# EAGLE design PowerSup24V18-20A (EAGLE 8.3.2)

## Sheet 1 of 3: Main Power High Side
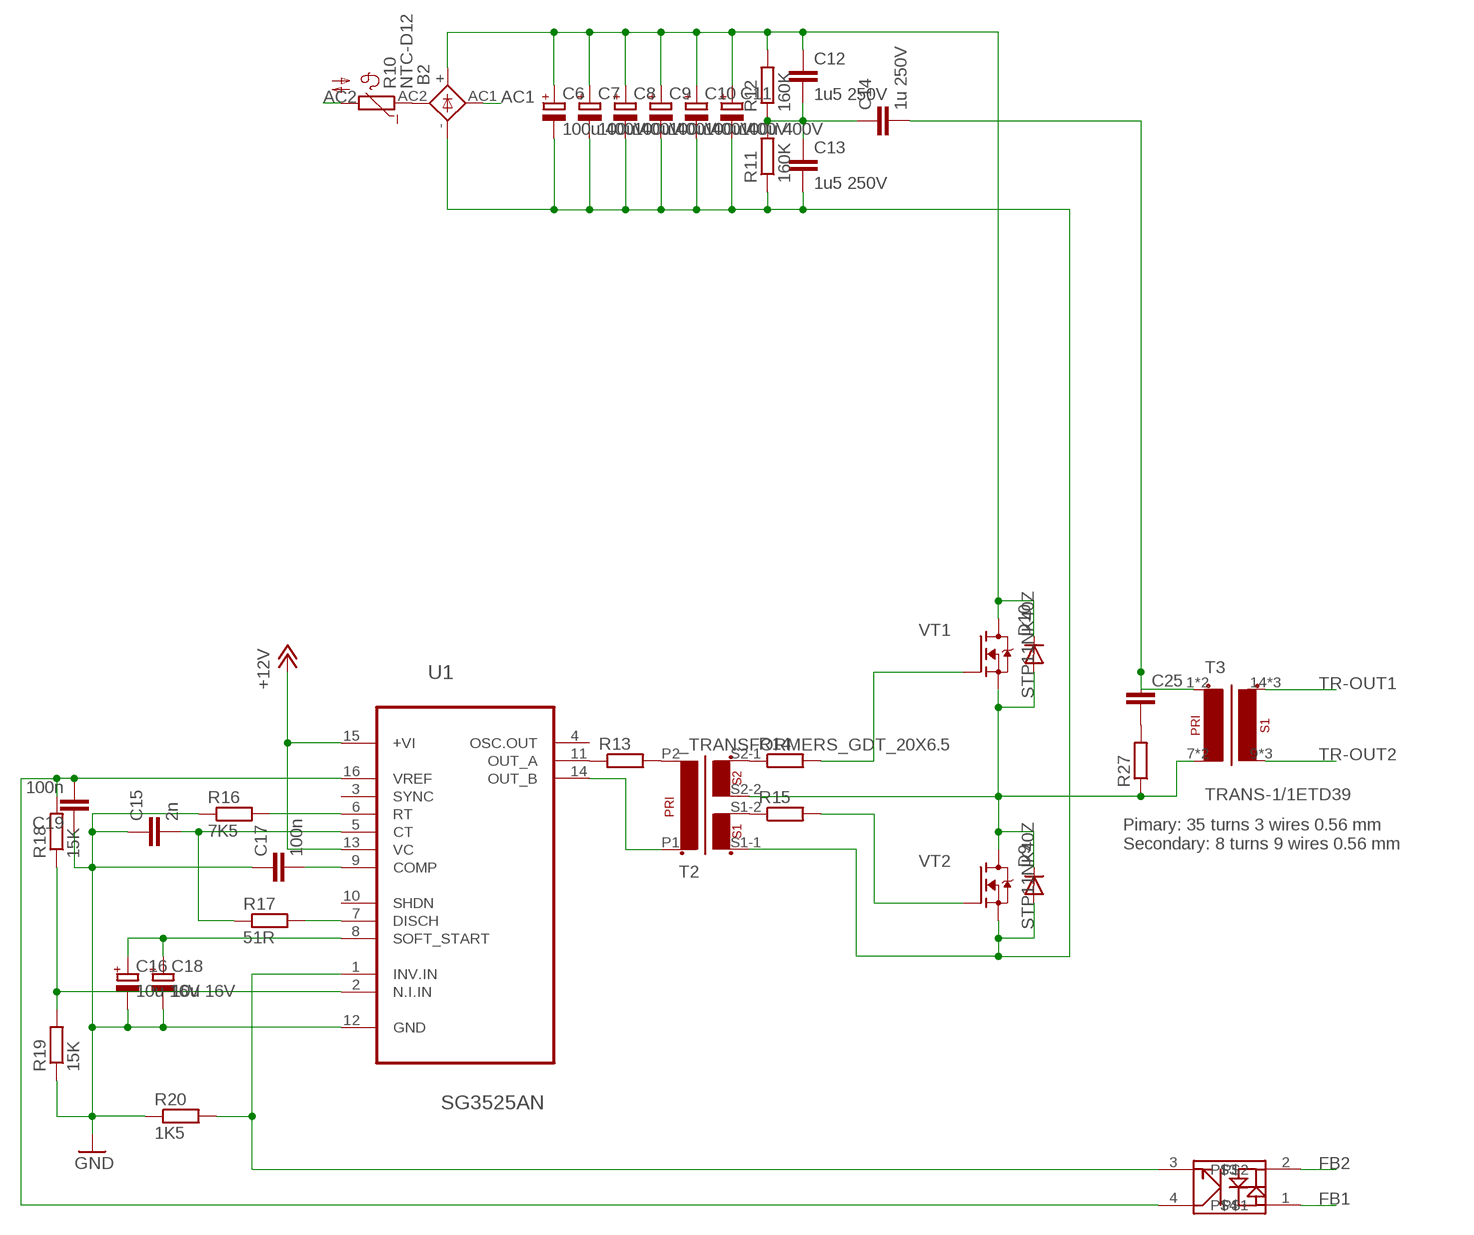
[diagram p0: schematic, sheet 1]

### Parts
B2  RECTIFIERKBL  [KBL]
C6  100u 400V  CPOL-EUE7.5-18  [E7,5-18]
C7  100u 400V  CPOL-EUE7.5-18  [E7,5-18]
C8  100u 400V  CPOL-EUE7.5-18  [E7,5-18]
C9  100u 400V  CPOL-EUE7.5-18  [E7,5-18]
C10  100u 400V  CPOL-EUE7.5-18  [E7,5-18]
C11  100u 400V  CPOL-EUE7.5-18  [E7,5-18]
C12  1u5 250V  C-EU225-074X268  [C225-074X268]
C13  1u5 250V  C-EU225-074X268  [C225-074X268]
C14  1u 250V  C-EU225-074X268  [C225-074X268]
C15  2n  CAP_0805  [C0805]
C16  10u 16V  CAP-POL_3528  [CT3528]
C17  100n  CAP_0805  [C0805]
C18  10u 16V  CAP-POL_3528  [CT3528]
C19  100n  CAP_0805  [C0805]
C25  CAP_C50-024X044  [C050-024X044]
D9  DIODE_ES1J  [DO214AC]
D10  DIODE_ES1J  [DO214AC]
R10  NTC-D12  [NTC-D12]
R11  160K  R_MF-0125  [MF-0125]
R12  160K  R_MF-0125  [MF-0125]
R13  R_1206  [R1206]
R14  R_1206  [R1206]
R15  R_1206  [R1206]
R16  7K5  R_0805  [R0805]
R17  51R  R_0805  [R0805]
R18  15K  R_0805  [R0805]
R19  15K  R_0805  [R0805]
R20  1K5  R_0805  [R0805]
R27  R_MF-2  [MF-2]
T2  _TRANSFORMERS_GDT_20X6.5  [_TRANSFORMERS_GDT_20X6.5]
T3  TRANS-1/1ETD39  [ETD39]
U1  SG3525AN  [DIP254P762X510-16]
U$1  OPTO-EL3H4(TA)-VG  [SSOP4]
VT1  STP11NK40Z  FET-NTO-220  [TO-220V]
VT2  STP11NK40Z  FET-NTO-220  [TO-220V]

### Nets
+12V: U1.13(VC) U1.15(+VI) ; also sheet 3
AC1: B2.AC1(AC2) ; also sheet 3
AC2: R10.2 ; also sheet 3
FB1: U$1.1 ; also sheet 2
FB2: U$1.2 ; also sheet 2
GND: C15.1 C16.- C17.1 C18.- C19.1 R16.1 R19.1 R20.1 U1.12(GND) ; also sheet 3
N$1: B2.AC2(AC1) R10.1
N$12: C12.2 C13.1 C14.1 R11.2 R12.1
N$13: B2.+ C6.+ C7.+ C8.+ C9.+ C10.+ C11.+ C12.1 D10.C R12.2 VT1.2(D)
N$19: B2.- C6.- C7.- C8.- C9.- C10.- C11.- C13.2 D9.A R11.1 T2.S1-1 VT2.3(S)
N$20: R13.1 U1.11(OUT_A)
N$21: T2.P1(P1-1) U1.14(OUT_B)
N$22: R13.2 T2.P2(P1-2)
N$23: R14.1 T2.S2-1
N$24: R15.1 T2.S1-2
N$25: R14.2 VT1.1(G)
N$26: R15.2 VT2.1(G)
N$27: D9.C D10.A R27.1 T2.S2-2 T3.7(P1-2) T3.8(P1-2) VT1.3(S) VT2.2(D)
N$28: C14.2 C25.1 T3.1(P1-1) T3.2(P1-1)
N$29: R16.2 U1.6(RT)
N$30: C15.2 R17.1 U1.5(CT)
N$31: C19.2 R18.2 U1.16(VREF) U$1.4
N$32: R17.2 U1.7(DISCH)
N$33: C16.+ C18.+ U1.8(SOFT_START)
N$34: R18.1 R19.2 U1.2(N.I.IN)
N$35: C17.2 U1.9(COMP)
N$36: R20.2 U1.1(INV.IN) U$1.3
N$44: C25.2 R27.2
TR-OUT1: T3.9(S1-2) T3.10(S1-2) T3.11(S1-2) ; also sheet 2
TR-OUT2: T3.14(S1-1) T3.15(S1-1) T3.16(S1-1) ; also sheet 2
Unconnected: U1.3(SYNC) U1.4(OSC.OUT) U1.10(SHDN)

### Notes on the sheet
- Pimary: 35 turns 3 wires 0.56 mm
  Secondary: 8 turns 9 wires 0.56 mm

## Sheet 2 of 3
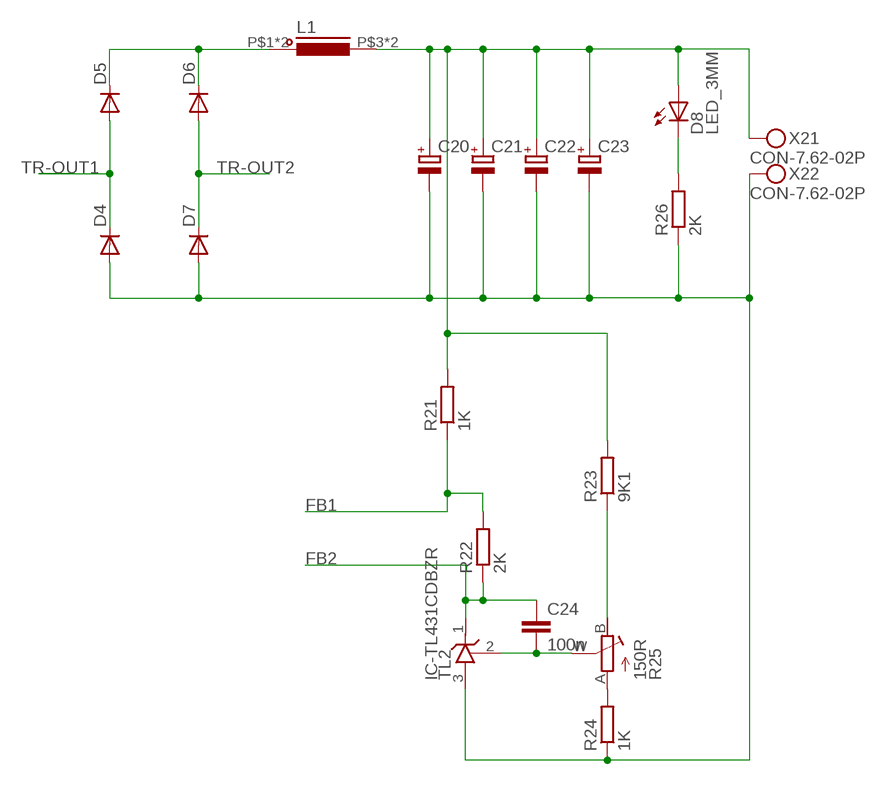
[diagram p1: schematic, sheet 2]

### Parts
C20  CPOL-EUE5-13  [E5-13]
C21  CPOL-EUE5-13  [E5-13]
C22  CPOL-EUE5-13  [E5-13]
C23  CPOL-EUE5-13  [E5-13]
C24  100n  CAP_0805  [C0805]
D4  DIODE_TO-220-2  [TO220ACS]
D5  DIODE_TO-220-2  [TO220ACS]
D6  DIODE_TO-220-2  [TO220ACS]
D7  DIODE_TO-220-2  [TO220ACS]
D8  LED_3MM  [LED3MM]
L1  INDUCTORD26.7  [D26.9/14.7/11.2]
R21  1K  R_0805  [R0805]
R22  2K  R_0805  [R0805]
R23  9K1  R_0805  [R0805]
R24  1K  R_0805  [R0805]
R25  150R  R_POTTURN-X  [RJ9W]
R26  2K  R_0805  [R0805]
TL2  IC-TL431CDBZR  [SOT23]
X2  CON-7.62-02P  [KF25C-7.62-02P-13]

### Nets
FB1: R21.1 R22.2 ; also sheet 1
FB2: C24.1 R22.1 TL2.1(C) ; also sheet 1
N$37: D5.C D6.C L1.P$1 L1.P$2
N$38: C20.- C21.- C22.- C23.- D4.A D7.A R24.1 R26.1 TL2.3(A) X2.P$2
N$39: C20.+ C21.+ C22.+ C23.+ D8.A L1.P$3 L1.P$4 R21.2 R23.2 X2.P$1
N$40: R24.2 R25.A
N$41: R23.1 R25.B(E)
N$42: C24.2 R25.W(S) TL2.2(R)
N$43: D8.K(C) R26.2
TR-OUT1: D4.C D5.A ; also sheet 1
TR-OUT2: D6.A D7.C ; also sheet 1

## Sheet 3 of 3: Standby power +12V
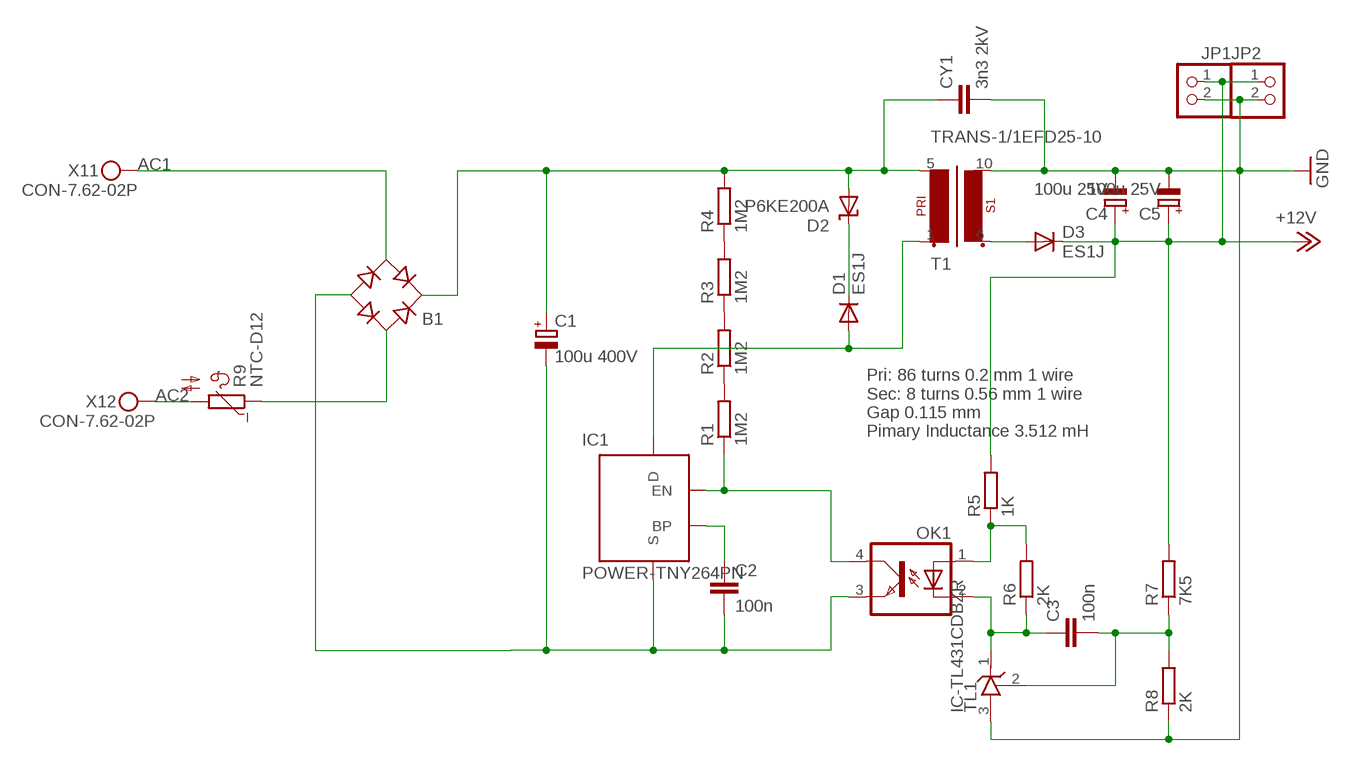
[diagram p2: schematic, sheet 3]

### Parts
B1  RB1A  [RB1A]
C1  100u 400V  CPOL-EUE7.5-18  [E7,5-18]
C2  100n  CAP_0805  [C0805]
C3  100n  CAP_0805  [C0805]
C4  100u 25V  CAP-POL_E2.5-7  [E2,5-7]
C5  100u 25V  CAP-POL_E2.5-7  [E2,5-7]
CY1  3n3 2kV  CYYC7B5  [YC7B5]
D1  ES1J  DIODE_ES1J  [DO214AC]
D2  P6KE200A  SUPRESSORDO-204AC  [DO15-12]
D3  ES1J  DIODE_ES1J  [DO214AC]
IC1  POWER-TNY264PN  [DIP-8B]
JP1  PINHD-1X2  [1X02]
JP2  PINHD-1X2  [1X02]
OK1  OPTOTRANSPC817  [DIL04]
R1  1M2  R_0805  [R0805]
R2  1M2  R_0805  [R0805]
R3  1M2  R_0805  [R0805]
R4  1M2  R_0805  [R0805]
R5  1K  R_0805  [R0805]
R6  2K  R_0805  [R0805]
R7  7K5  R_0805  [R0805]
R8  2K  R_0805  [R0805]
R9  NTC-D12  [NTC-D12]
T1  TRANS-1/1EFD25-10  [EFD25_10PIN]
TL1  IC-TL431CDBZR  [SOT23]
X1  CON-7.62-02P  [KF25C-7.62-02P-13]

### Nets
+12V: C4.+ C5.+ D3.C JP1.1 JP2.1 R5.2 R7.2 ; also sheet 1
AC1: B1.AC2 X1.P$1 ; also sheet 1
AC2: R9.2 X1.P$2 ; also sheet 1
GND: C4.- C5.- CY1.2 JP1.2 JP2.2 R8.1 T1.10(S1-2) TL1.3(A) ; also sheet 1
N$2: B1.AC1 R9.1
N$3: B1.+ C1.+ CY1.1 D2.A R4.2 T1.5(P1-2)
N$4: B1.- C1.- C2.2 IC1.2(S) IC1.3(S) IC1.7(S) IC1.8(S) OK1.3(EMIT)
N$5: R1.2 R2.1
N$6: R2.2 R3.1
N$7: R3.2 R4.1
N$8: IC1.4(EN) OK1.4(COL) R1.1
N$9: D1.A IC1.5(D) T1.1(P1-1)
N$10: D1.C D2.C
N$11: C2.1 IC1.1(BP)
N$14: C3.1 OK1.2(C) R6.1 TL1.1(C)
N$15: OK1.1(A) R5.1 R6.2
N$16: C3.2 R7.1 R8.2 TL1.2(R)
N$18: D3.A T1.6(S1-1)

### Notes on the sheet
- Pri: 86 turns 0.2 mm 1 wire
  Sec: 8 turns 0.56 mm 1 wire
  Gap 0.115 mm
  Pimary Inductance 3.512 mH

## Library data of the parts
B1 = rectifier:RB1A: RECTIFIER 1 A
B2 = Namenlos:RECTIFIER: DIOTEC RECTIFIER
C1 C6-C11 C20-C23 = rcl:CPOL-EU: POLARIZED CAPACITOR, European symbol
C2 C3 C15 C17 C19 C24 C25 = Namenlos:CAP_
C4 C5 C16 C18 = Namenlos:CAP-POL_
C12-C14 = rcl:C-EU: CAPACITOR, European symbol
CY1 = rcl:CY: Y CAPACITOR for power line
D1 D3-D7 D9 D10 = Namenlos:DIODE_
D2 = Namenlos:SUPRESSOR
D8 = Namenlos:LED_
IC1 = Namenlos:POWER-TNY264PN
JP1 JP2 = pinhead:PINHD-1X2: PIN HEADER
L1 = Namenlos:INDUCTOR
OK1 = Namenlos:OPTOTRANS: SHARP OPTO COUPLER; MPN: PC817X4J000F; OC_FARNELL: 9707727; OC_NEWARK: 97K7059
R1-R8 R11-R24 R26 R27 = Namenlos:R_
R9 R10 = Namenlos:NTC-D12
R25 = Namenlos:R_POT
T1 T3 = Namenlos:TRANS-1/1
T2 = Namenlos:_TRANSFORMERS_GDT_20X6.5
TL1 TL2 = Namenlos:IC-TL431
U1 = Namenlos:SG3525AN: REGULATING PULSE WIDTH MODULATORS; MPN: SG3525AN; OC_FARNELL: 1564368; OC_NEWARK: 89K1506; PACKAGE: PDIP-16; SUPPLIER: STMICROELECTRONICS
U$1 = Namenlos:OPTO-EL3H4(TA)-VG
VT1 VT2 = Namenlos:FET-N
X1 X2 = Namenlos:CON-7.62-02P

## Board
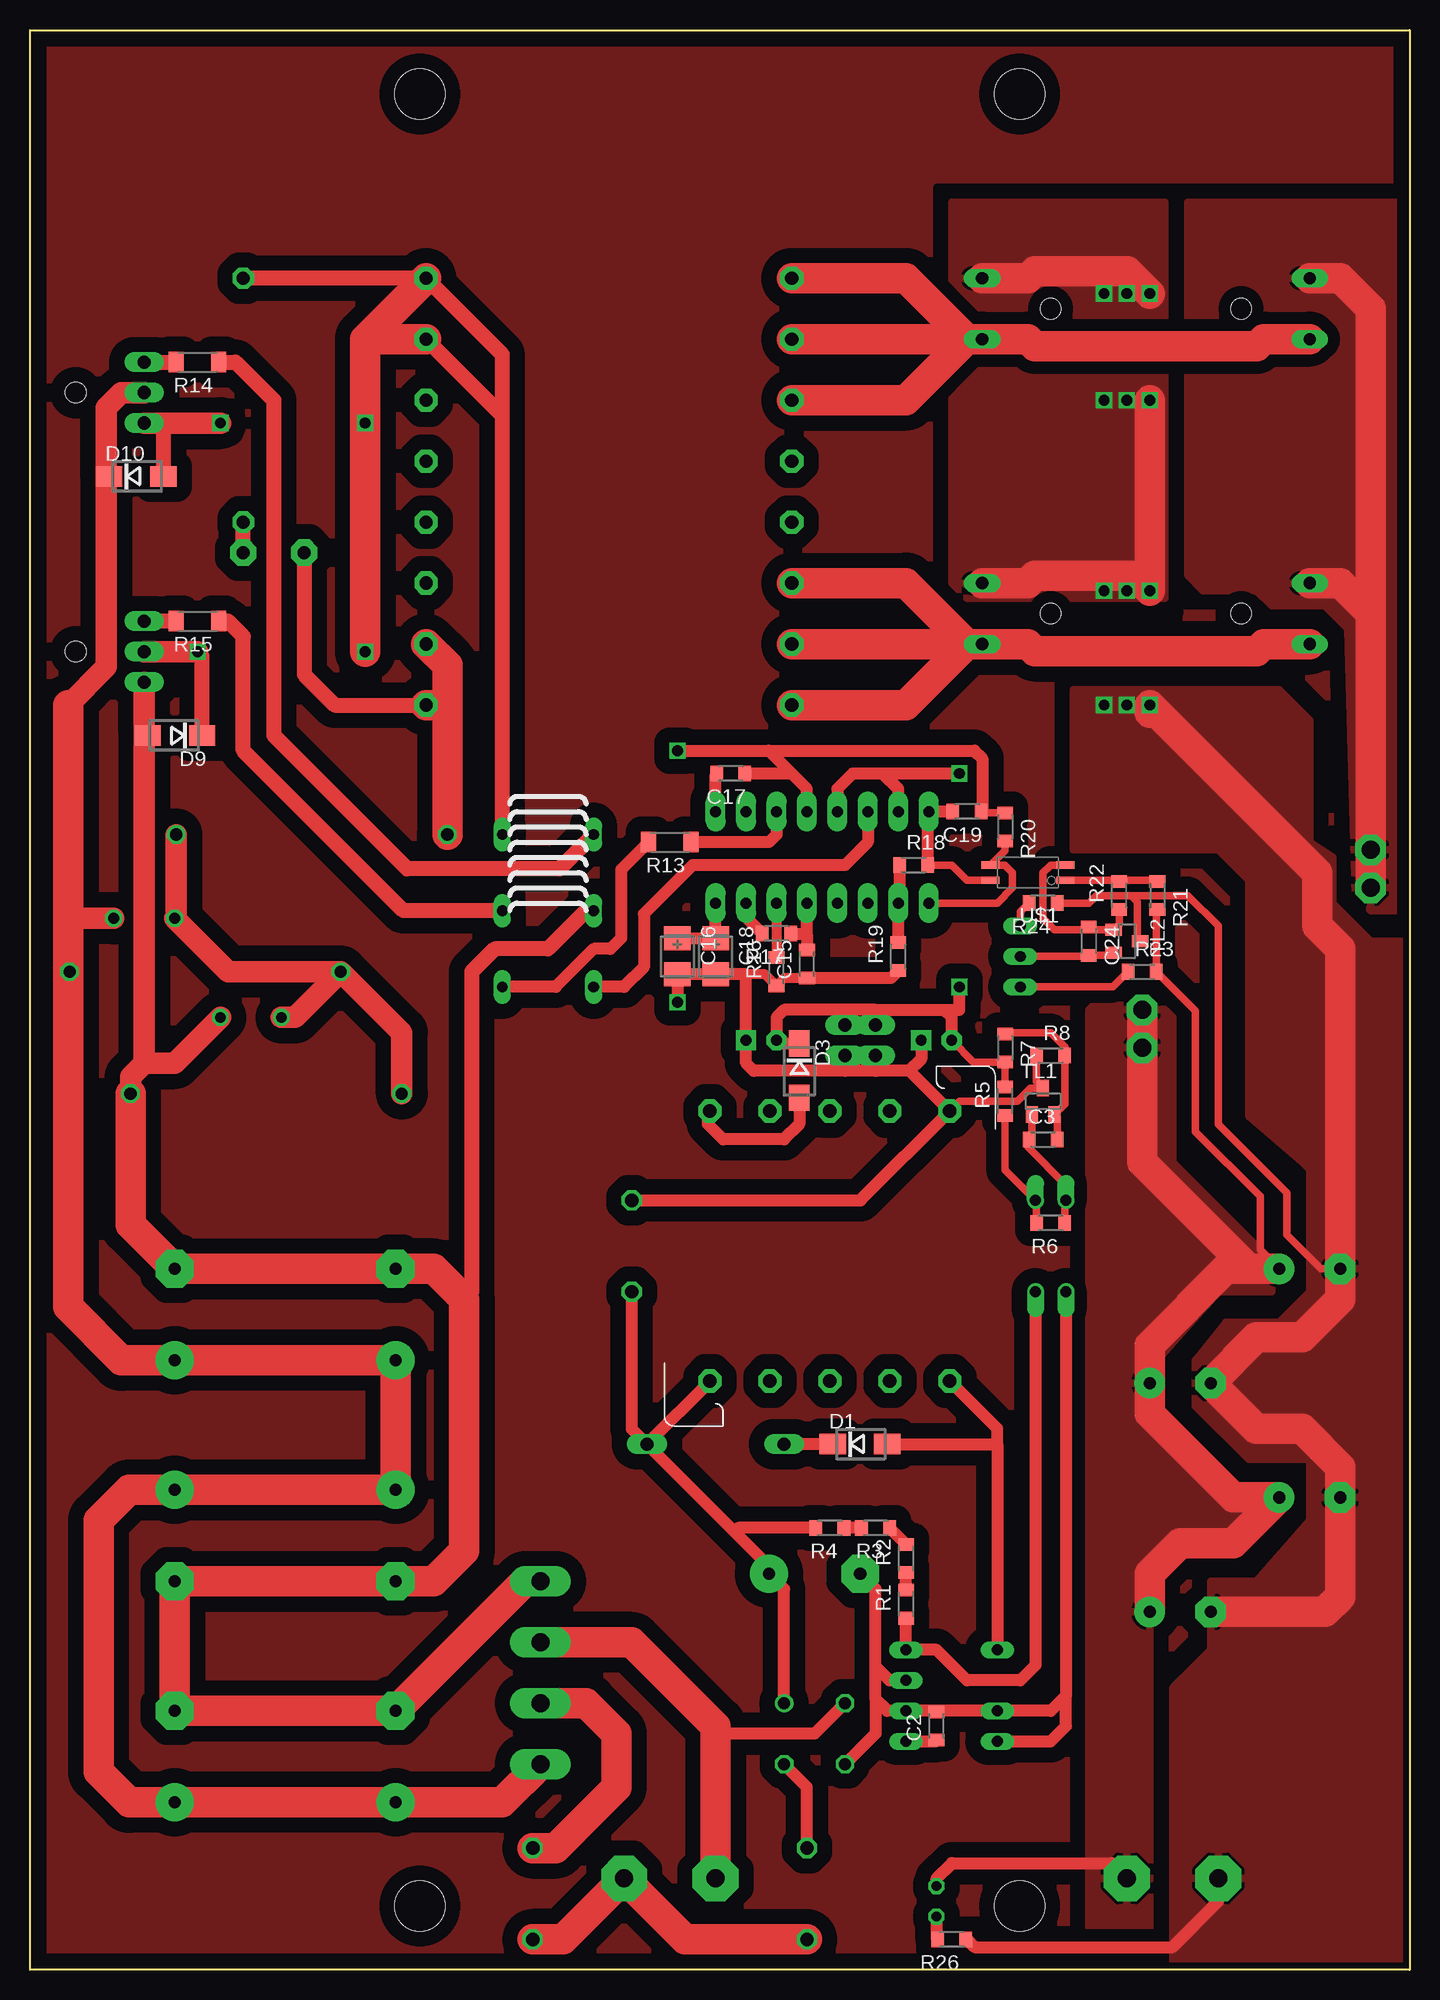
[diagram p3: board, top side]
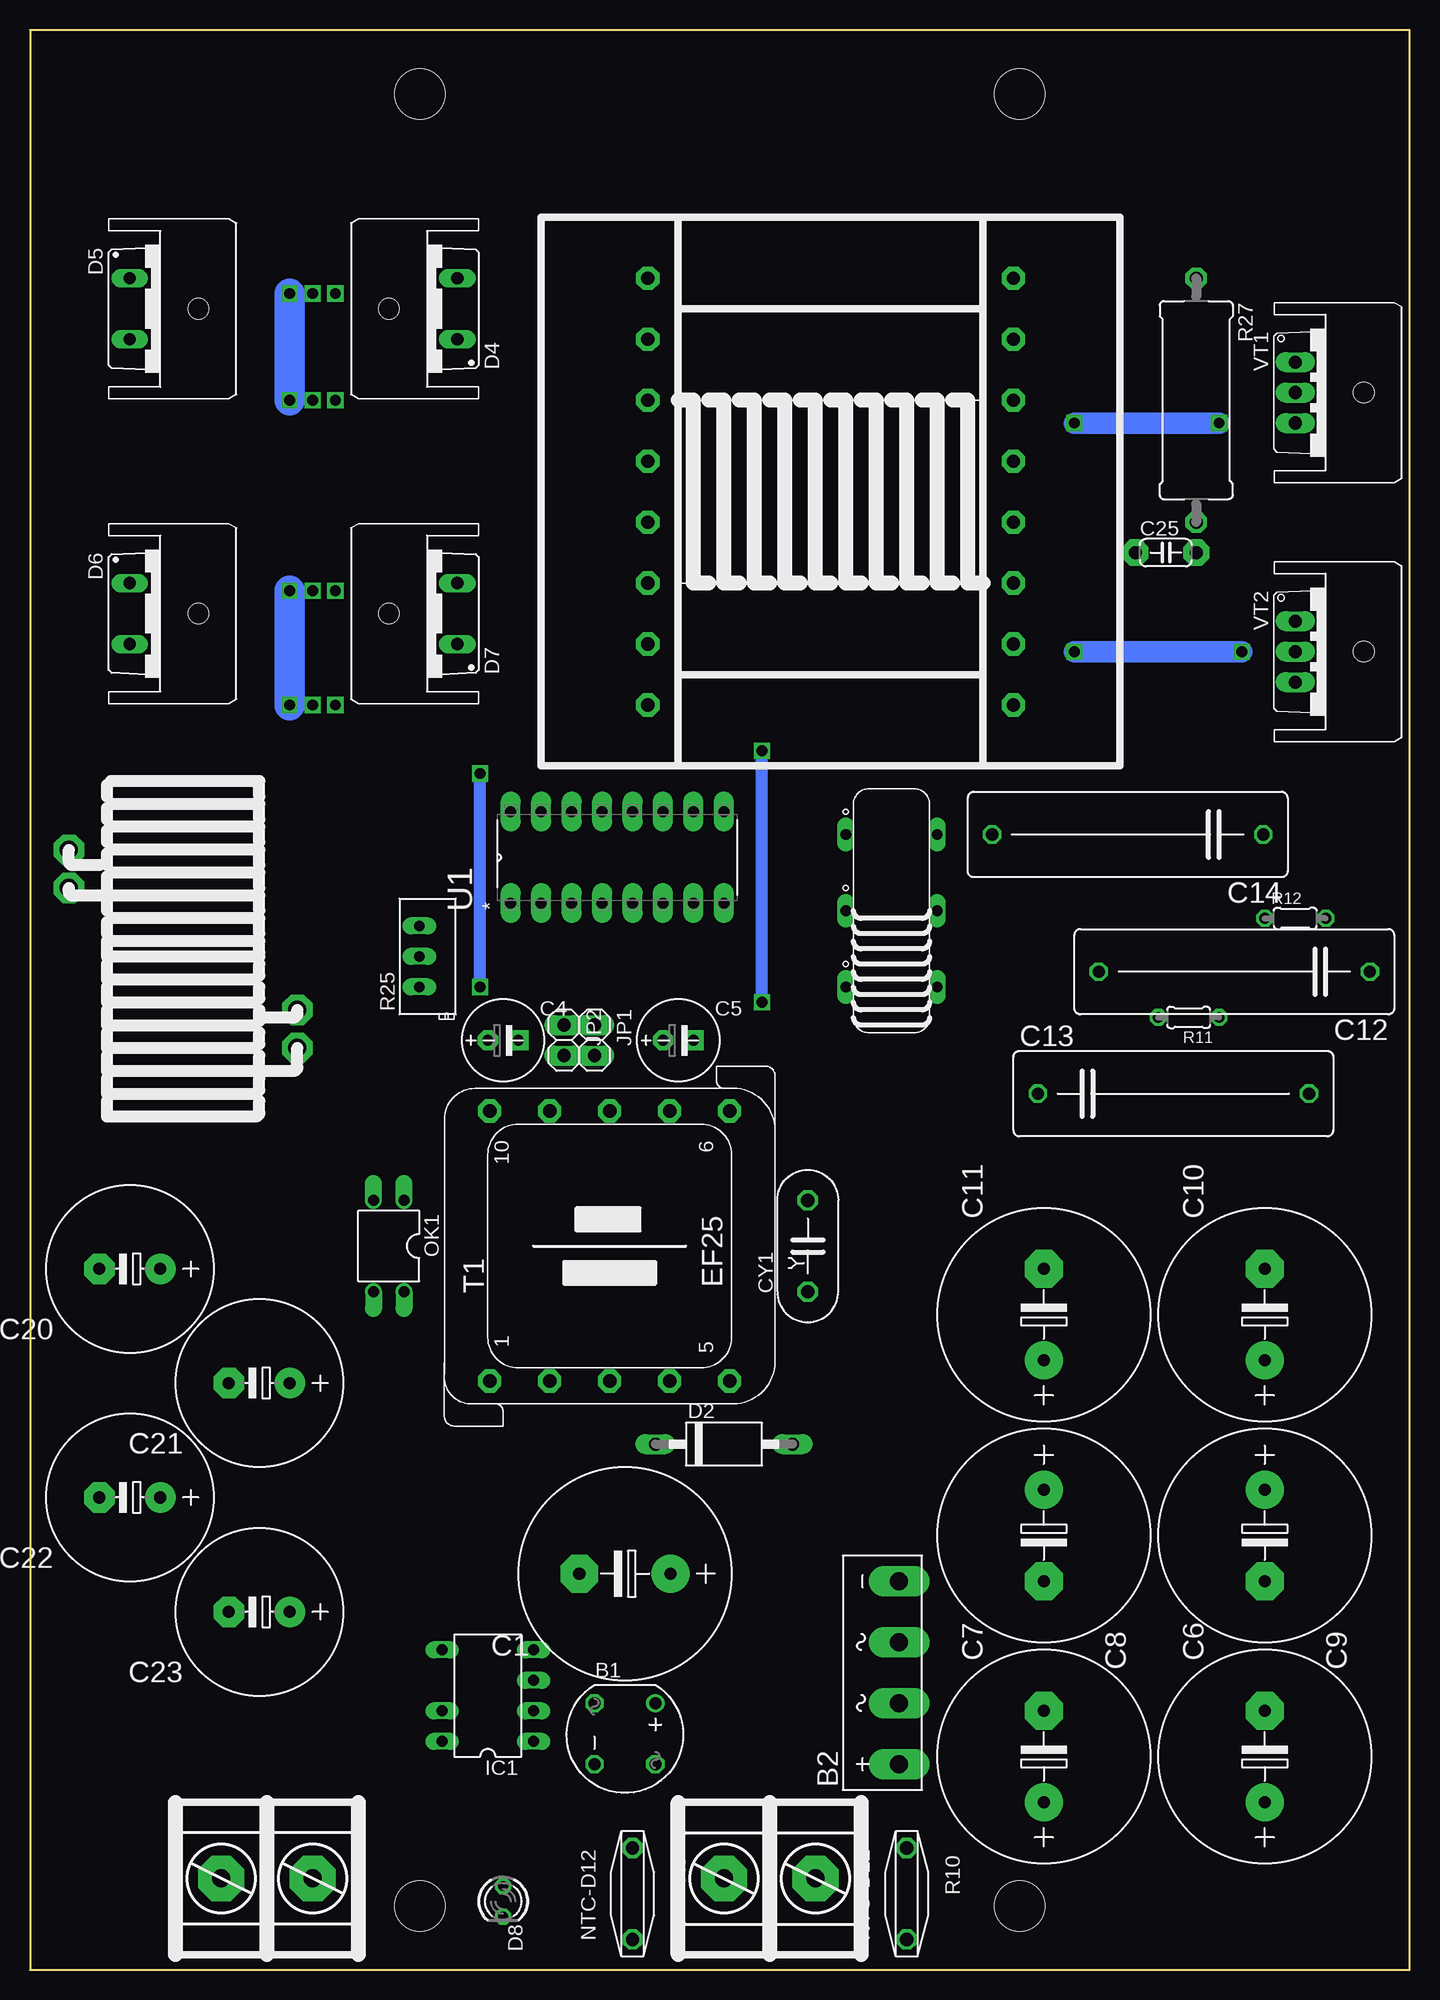
[diagram p4: board, bottom side, seen from below]

Size 115 x 161.66 mm. Coordinates in mm from the lower left corner, seen from the top.
Outline: 115,161.66 115,0 0,0 0,161.66 115,161.66
Copper layers (1*16): Top 0.035mm / dielectric 1.5mm / Bottom 0.035mm
Design rules "EagleDesignRules": minimum track width 0.2mm, minimum drill 0.3mm, track to track 0.2mm, track to pad 0.2mm, pad to pad 0.2mm, via to via 0.2mm, smd to smd 0.2mm, copper to edge 0.5mm, drill to drill 0.2mm, minimum pad ring 10mil, minimum via ring 8mil, stop-mask expansion 4mil, vias tented up to drill 0mil, thermal gap 0.25mm
Holes 4.2 mm at 32.5,5.33 32.5,156.33 82.5,156.33 82.5,5.33

### Footprints (pad centres in the part's own frame; a part is rotated, then mirrored left to right if it is on the bottom)
RB1A = drill 1.016: + -2.54,2.54 | drill 1.016 octagon: - 2.54,-2.54; AC1 2.54,2.54; AC2 -2.54,-2.54
KBL = drill 1.5 pad 2.54 long: + -7.62,-1.27; - 7.62,-1.27; AC1 2.54,-1.27; AC2 -2.54,-1.27
E7,5-18 = drill 1.016 pad 3.15: + -3.81,0 | drill 1.016 pad 3.15 octagon: - 3.81,0
C0805 = smd 1.05 x 1.3: 1 -1.175,0; 2 1.175,0
E2,5-7 = drill 0.9 pad 1.676 octagon: + -1.27,0 | drill 0.9 pad 1.676 square: - 1.27,0
C225-074X268 = drill 1.016 octagon: 1 -11.303,0; 2 11.303,0
CT3528 = smd 2 x 2.2: + -1.5,0; - 1.5,0
E5-13 = drill 1.016 pad 2.54: + -2.54,0 | drill 1.016 pad 2.54 octagon: - 2.54,0
C050-024X044 = drill 1.1 pad 2.184 octagon: 1 -2.54,0; 2 2.54,0
YC7B5 = drill 1.118 octagon: 1 -3.81,0; 2 3.81,0
DO214AC = smd 2.2 x 1.7: A 2.25,0; C -2.285,0
DO15-12 = drill 1.1 pad 1.676 long: A 5.08,0; C -6.35,0
TO220ACS = drill 1.016 long: A 2.54,-2.54; C -2.54,-2.54
LED3MM = drill 0.813 octagon: A -1.27,0; K 1.27,0
DIP-8B = drill 0.9 long: 1 -3.81,-3.81; 2 -1.27,-3.81; 3 1.27,-3.81; 4 3.81,-3.81; 5 3.81,3.81; 7 -1.27,3.81; 8 -3.81,3.81
1X02 = drill 1.1 long: 1 -1.27,0; 2 1.27,0
D26.9/14.7/11.2 = drill 1.5 pad 2.54 octagon: P$1 -9.525,8.255; P$2 -9.525,5.08; P$3 9.525,-5.08; P$4 9.525,-8.255
DIL04 = drill 0.9 pad 1.27 offset: 1 -1.27,-3.81; 2 1.27,-3.81; 3 1.27,3.81; 4 -1.27,3.81
R0805 = smd 1.05 x 1.3: 1 -1.175,0; 2 1.175,0
NTC-D12 = drill 1.1 pad 1.676 octagon: 1 -3.81,0; 2 3.81,0
MF-0125 = drill 0.9 octagon: 1 -2.54,0; 2 2.54,0
R1206 = smd 1.25 x 1.7: 1 -1.775,0; 2 1.775,0
RJ9W = drill 0.9 long: A 2.54,0.635; B -2.54,0.635; W 0,0.635
MF-2 = drill 1.1 pad 1.778 octagon: 1 -10.16,0; 2 10.16,0
EFD25_10PIN = drill 1.1 pad 1.93 octagon: 1 -11.25,10; 2 -11.25,5; 3 -11.25,0; 4 -11.25,-5; 5 -11.25,-10; 6 11.25,-10; 7 11.25,-5; 8 11.25,0; 9 11.25,5; 10 11.25,10
_TRANSFORMERS_GDT_20X6.5 = drill 0.9 long: P1 -6.35,3.81; P2 -6.35,-3.81; S1-1 0,3.81; S1-2 0,-3.81; S2-1 6.35,3.81; S2-2 6.35,-3.81
ETD39 = drill 1.1 pad 1.93 octagon: 1 -17.78,-15.24; 2 -12.7,-15.24; 3 -7.62,-15.24; 4 -2.54,-15.24; 5 2.54,-15.24; 6 7.62,-15.24; 7 12.7,-15.24; 8 17.78,-15.24; 9 17.78,15.24; 10 12.7,15.24; 11 7.62,15.24; 12 2.54,15.24; 13 -2.54,15.24; 14 -7.62,15.24; 15 -12.7,15.24; 16 -17.78,15.24
SOT23 = smd 1 x 1.4: 1 -0.95,-1.1; 2 0.95,-1.1; 3 0,1.1
DIP254P762X510-16 = drill 0.9 pad 1.676 long: 1 -3.81,8.89; 2 -3.81,6.35; 3 -3.81,3.81; 4 -3.81,1.27; 5 -3.81,-1.27; 6 -3.81,-3.81; 7 -3.81,-6.35; 8 -3.81,-8.89; 9 3.81,-8.89; 10 3.81,-6.35; 11 3.81,-3.81; 12 3.81,-1.27; 13 3.81,1.27; 14 3.81,3.81; 15 3.81,6.35; 16 3.81,8.89
SSOP4 = smd 0.6 x 1.5: 1 -0.635,-3.115; 2 0.635,-3.115; 3 0.635,3.115; 4 -0.635,3.115
SK95-3M3_HOLE = hole 1.7: 0,3.175
TO-220V = drill 1.1 long: 1 -2.54,-2.54; 2 0,-2.54; 3 2.54,-2.54
KF25C-7.62-02P-13 = drill 1.5 pad 3.81 octagon: P$1 -3.81,0; P$2 3.81,0

### Placement (x,y rotation side)
B1  65.41,19.68 270 bottom
B2  43.81,24.77 90 bottom
C1  65.41,33.02 180 bottom
C2  75.56,20.32 90 top
C3  84.45,69.22 0 top
C4  75.56,77.47 0 bottom
C5  60.96,77.47 0 bottom
C6  12.06,17.78 90 bottom
C7  30.48,17.78 90 bottom
C8  30.48,36.2 270 bottom
C9  12.06,36.2 270 bottom
C10  12.06,54.61 90 bottom
C11  30.48,54.61 90 bottom
C12  14.6,83.19 180 bottom
C13  19.69,73.02 0 bottom
C14  23.49,94.61 180 bottom
C15  64.77,83.82 90 top
C16  53.97,84.45 270 top
C17  58.42,99.69 180 top
C18  57.15,84.45 270 top
C19  78.1,96.52 180 top
C20  106.68,58.42 180 bottom
C21  95.88,48.89 180 bottom
C22  106.68,39.37 180 bottom
C23  95.88,29.84 180 bottom
C24  88.27,85.72 270 top
C25  20.32,118.11 0 bottom
CY1  50.16,60.33 90 bottom
D1  69.22,43.81 0 top
D2  56.51,43.81 0 bottom
D3  64.13,74.93 270 top
D4  81.91,138.43 90 bottom
D5  104.14,138.43 270 bottom
D6  104.14,113.03 270 bottom
D7  81.91,113.03 90 bottom
D8  75.56,5.71 270 bottom
D9  12.06,102.87 180 top
D10  8.89,124.46 0 top
IC1  76.83,22.86 90 bottom
JP1  67.94,77.47 270 bottom
JP2  70.48,77.47 270 bottom
L1  102.23,85.09 0 bottom
OK1  85.09,60.33 180 bottom
R1  73.03,30.48 90 top
R2  73.03,34.29 90 top
R3  70.48,36.83 180 top
R4  66.67,36.83 180 top
R5  81.28,72.39 90 top
R6  85.09,62.23 180 top
R7  81.28,76.83 270 top
R8  85.09,76.2 0 top
R9  64.77,6.35 270 bottom
R10  41.91,6.35 270 bottom
R11  18.41,79.38 180 bottom
R12  9.52,87.63 0 bottom
R13  53.34,93.98 180 top
R14  13.97,133.99 180 top
R15  13.97,112.39 180 top
R16  62.23,83.19 90 top
R17  62.23,86.36 180 top
R18  73.66,92.08 0 top
R19  72.39,84.45 90 top
R20  81.28,95.25 270 top
R21  93.98,89.53 270 top
R22  90.8,89.53 90 top
R23  92.71,83.19 0 top
R24  84.45,88.9 180 top
R25  81.91,84.45 90 bottom
R26  76.83,2.54 180 top
R27  17.78,130.81 270 bottom
T1  66.67,60.33 90 bottom
T2  43.18,88.27 90 bottom
T3  48.26,123.19 90 bottom
TL1  84.45,72.39 0 top
TL2  91.44,85.72 270 top
U1  66.04,92.71 90 bottom
U$1  83.19,91.44 90 top
U$2  [SK95-3M3_HOLE]  6.98,131.44 270 bottom
U$3  [SK95-3M3_HOLE]  6.98,109.86 270 bottom
U$4  [SK95-3M3_HOLE]  104.14,138.43 270 bottom
U$5  [SK95-3M3_HOLE]  81.91,138.43 90 bottom
U$6  [SK95-3M3_HOLE]  104.14,113.03 270 bottom
U$7  [SK95-3M3_HOLE]  81.91,113.03 90 bottom
VT1  6.98,131.44 270 bottom
VT2  6.98,109.86 270 bottom
X1  53.34,7.62 0 bottom
X2  95.25,7.62 180 bottom

### Tracks (layer width: path | path; a pad name or v marks a point on that pad's centre or on a via)
+12V  (via drill 0.9)
  Top 0.61: R5.2 R7.2 78.64,75.66 C4.+
  Top 1.016: D3.C 62.48,77.22 C5.+ 62.23,79.38 62.86,80.01 67.94,80.01 | C4.+ 76.83,79.38 76.2,80.01 | 70.48,80.01 67.94,80.01 | 70.48,80.01 74.93,80.01 76.2,80.01 | U1.15 72.39,98.42 71.12,99.69 | 71.12,99.69 68.58,99.69 67.31,98.42 U1.13 | 76.2,80.01 77.47,80.01 v77.47,81.91 | v77.47,99.69 71.12,99.69 | JP1.1 67.94,80.01 | JP2.1 70.48,80.01
  Bottom 1.016: v77.47,81.91 v77.47,99.69
AC1
  Top 1.016: B1.AC2 65.41,19.68 57.78,19.68 57.15,20.32
  Top 2.54: X1.P$1 57.15,20.32 50.16,27.3 B2.AC1
AC2
  Top 2.54: R9.2 54.61,2.54 X1.P$2 44.45,2.54 R10.2
FB1
  Top 0.61: 90.8,90.8 U$1.1 | 90.8,90.8 93.88,90.8 R21.1 | R22.2 90.8,90.8
FB2
  Top 0.61: R22.1 90.8,87.14 TL2.1 88.49,86.67 | 88.49,86.67 C24.1 | U$1.2 85.09,92.08 84.45,91.44 84.45,87.63 85.41,86.67 88.49,86.67
GND  (via drill 0.9)
  Top 0.61: R20.1 79.38,96.42 C19.1 | R8.1 83.91,74.03 TL1.3 83.4,73.49 82.3,72.39 77.49,72.39 T1.10
  Top 0.813: C15.1 62.86,82.64 R16.1 61.28,82.95 59.69,82.95
  Top 1.016: CY1.2 69.23,64.14 T1.10 73.32,74.93 | 70.48,74.93 67.94,74.93 | 67.94,74.93 60.32,74.93 59.69,75.56 C5.- 59.69,82.95 C18.- C16.- v53.97,80.64 | U1.12 64.77,98.42 63.5,99.69 | 63.5,99.69 C17.1 | C15.1 71.75,82.64 R19.1 | v53.97,101.6 61.59,101.6 | 61.59,101.6 63.5,99.69 | 61.59,101.6 78.74,101.6 79.38,100.97 79.38,96.61 C19.1 | JP2.2 70.48,74.93 | JP1.2 67.94,74.93 | 73.32,74.93 70.48,74.93 | C4.- 74.29,75.91 73.32,74.93
  Bottom 1.016: v53.97,80.64 v53.97,101.6
N$1
  Top 2.54: R10.1 43.81,10.16 48.89,15.24 48.89,19.68 46.35,22.23 B2.AC2
N$2
  Top 1.016: R9.1 64.77,15.24 B1.AC1
N$3
  Top 1.016: D2.A 51.43,43.83 T1.5 | B1.+ 62.86,31.75 C1.+ 61.59,33.66 58.74,36.51 | 58.74,36.51 D2.A | R4.2 59.05,36.83 58.74,36.51 | CY1.1 50.16,45.08 D2.A
N$4
  Top 1.016: B1.- 70.48,19.68 70.48,22.58 | 70.48,22.58 70.48,25.29 | 86.36,22.86 85.09,21.59 IC1.7 75.47,21.59 | IC1.8 85.09,19.05 86.36,20.32 86.36,22.86 | 75.47,21.59 IC1.2 71.47,21.59 70.48,22.58 | 75.47,21.59 C2.2 | IC1.3 71.65,24.13 70.48,25.29 | C1.- 70.48,31.75 70.48,25.29 | OK1.3 86.36,22.86
N$5
  Top 1.016: R1.2 R2.1
N$6
  Top 1.016: R2.2 R3.1
N$7
  Top 1.016: R3.2 R4.1
N$8
  Top 1.016: R1.1 IC1.4 75.56,26.67 78.1,24.13 82.55,24.13 83.82,25.4 OK1.4
N$9
  Top 1.016: 80.64,43.81 IC1.5 | 80.64,43.81 80.64,45.11 T1.1 | D1.A 80.64,43.81
N$10
  Top 1.016: D1.C D2.C
N$11
  Top 1.016: IC1.1 75.47,19.05 C2.1
N$12
  Top 1.778: R11.2 22.1,79.38 C12.2 | C12.2 16.51,83.19 R12.1 12.19,87.76 C14.1 | C13.1 30.99,78.11 C12.2
N$13
  Top 1.27: D10.C 6.45,124.46 6.35,124.56
  Top 1.778: 3.17,105.41 6.35,108.58 6.35,124.56 6.35,130.18 7.62,131.44 VT1.2 | 3.3,83.31 C12.1 3.17,83.19 | R12.2 3.17,87.63
  Top 2.54: B2.+ 39.37,13.97 C7.+ C6.+ 8.25,13.97 5.71,16.51 5.71,37.47 8.25,40 C9.+ C8.+ C11.+ C10.+ 7.62,50.8 3.17,55.25 3.17,83.19 3.17,87.63 3.17,105.41
N$14
  Top 0.61: TL1.1 83.5,69.44 C3.1 83.19,69.12 83.19,68.58 86.36,65.41 OK1.2 86.27,64.04 R6.1
N$15
  Top 0.61: R6.2 83.91,64.04 OK1.1 81.28,66.67 R5.1
N$16
  Top 0.61: C3.2 85.63,71.06 TL1.2 86.27,72.15 R8.2 86.27,76.93 85.09,78.11 81.38,78.11 R7.1
N$18
  Top 1.016: D3.A 64.13,70.48 62.86,69.22 57.78,69.22 56.51,70.48 56.51,71.41 T1.6
N$19
  Top 1.27: T2.S1-1 46.35,88.27 43.18,85.09 38.73,85.09 36.83,83.19 36.83,56.52 36.19,55.88 | D9.A 9.76,102.87 9.52,103.1
  Top 1.778: 9.52,75.56 12.06,75.56 R11.1 | VT2.3 9.52,103.1 9.52,75.56 | C13.2 8.38,74.42 9.52,75.56
  Top 2.54: B2.- 41.27,32.38 C7.- C6.- C9.- C8.- 33.66,32.38 36.19,34.92 36.19,55.88 33.66,58.42 C11.- C10.- 8.38,62.1 C13.2
N$20
  Top 1.016: 62.23,95.25 U1.11 62.23,94.61 61.59,93.98 R13.1
N$21
  Top 1.016: U1.14 69.85,93.98 67.94,92.08 55.24,92.08 51.18,88.01 51.18,83.57 49.53,81.91 T2.P1
N$22
  Top 1.016: R13.2 49.28,91.69 49.28,85.98 48.39,85.09 46.99,85.09 43.81,81.91 T2.P2
N$23
  Top 1.27: R14.1 17.14,133.99 20.32,130.81 20.32,102.87 31.43,91.76 44.13,91.76 T2.S2-1
N$24
  Top 1.27: T2.S1-2 31.11,88.27 17.78,101.6 17.78,111.12 16.51,112.39 R15.1
N$25
  Top 1.27: VT1.1 R14.2
N$26
  Top 1.27: R15.2 VT2.1
N$27  (via drill 0.9)
  Top 1.27: 39.37,129.54 T2.S2-2 | 39.37,129.54 T3.7 | 39.37,129.54 39.37,134.62 T3.8 R27.1 | D10.A 11.14,128.65 11.39,128.9 | D9.C 14.35,109.48 v13.97,109.86
  Top 1.778: v13.97,109.86 VT2.2 | VT1.3 11.39,128.9 v15.88,128.9
  Top 2.54: v27.94,109.86 v27.94,128.9 27.94,135.89 | 27.94,135.89 T3.8 | T3.7 27.94,135.89
  Bottom 1.778: v15.88,128.9 v27.94,128.9 | v27.94,109.86 v13.97,109.86
N$28
  Top 1.27: C25.1 22.86,107.95 25.4,105.41 T3.1
  Top 2.54: 34.8,105.41 C14.2 | 34.8,105.41 34.8,108.71 T3.2 | T3.1 34.8,105.41
N$29
  Top 0.813: U1.6 R16.2
N$30
  Top 1.016: 64.77,86.28 U1.5 | 64.77,86.28 C15.2 | R17.1 64.69,86.36 64.77,86.28
N$31
  Top 0.61: U$1.4 78.1,90.8 76.83,92.08 R18.2
  Top 1.016: R18.2 74.83,96.42 U1.16 C19.2
N$32
  Top 1.016: U1.7 59.69,87.72 R17.2
N$33
  Top 1.016: U1.8 C18.+ C16.+
N$34
  Top 1.016: R18.1 72.48,89 U1.2 R19.2
N$35
  Top 1.016: U1.9 57.15,99.6 C17.2
N$36
  Top 0.61: R20.2 81.28,93.28 U$1.3 81.28,92.08 81.91,91.44 81.91,90.17 80.64,88.9 U1.1
N$37
  Top 2.54: D5.C 109.22,140.97 111.76,138.43 111.76,113.03 | D6.C 109.22,115.57 111.76,113.03 | 111.76,113.03 L1.P$1 L1.P$2
  pour Top (isolate 1.016): 114.94,88.27 111.76,88.27 110.49,89.53 109.85,111.76 107.95,113.67 103.5,113.67 102.23,114.93 97.79,114.93 96.52,116.2 96.52,147.32 114.94,147.32
N$38  (via drill 0.9)
  Top 0.61: R24.1 88.27,88.9 88.9,89.53 91.82,89.53 | 91.82,89.53 92.33,89.03 92.33,85.94 TL2.3 | 91.82,89.53 96.52,89.53 99.06,87 99.06,70.48 104.77,64.77 104.77,61.25 107.61,58.42 109.85,58.42
  Top 1.016: R26.1 78.1,2.54 78.74,1.9 95.25,1.9 99.06,5.71 X2.P$2
  Top 2.54: D4.A 83.19,140.97 83.79,141.57 91.48,141.57 v93.34,139.7 | D7.A 83.19,115.57 83.79,116.17 92.11,116.17 v93.34,114.93 v93.34,130.81 | 93.34,104.77 v93.34,105.41 107.31,91.44 107.31,87 109.22,85.09 C20.- 109.22,55.88 106.05,52.7 102.23,52.7 C21.- 102.23,45.08 106.05,45.08 109.22,41.91 C22.- 109.22,31.11 107.95,29.84 C23.-
  Bottom 2.54: v93.34,139.7 v93.34,130.81 | v93.34,114.93 v93.34,105.41
  other vias: 91.44,130.81 89.53,130.81 89.53,139.7 91.44,139.7 91.44,114.93 89.53,114.93 91.44,105.41 89.53,105.41
  pour Top: 114.94,0 95.25,0 95.25,23.49 98.42,26.67 98.42,32.38 102.23,32.38 106.68,37.47 106.68,42.55 101.6,42.55 97.16,46.99 97.16,50.8 99.69,53.97 104.14,53.97 106.68,56.52 106.68,66.67 106.05,67.31 101.6,71.12 101.6,90.8 99.06,93.34 87,93.34 87,106.68 104.14,106.68 106.68,104.14 106.68,93.98 108.58,92.71 108.58,88.9 111.76,85.72 114.94,85.72
  pour Top (isolate 1.016): 94.61,114.3 78.1,114.3 76.83,115.57 76.83,147.32 94.61,147.32
N$39
  Top 0.61: R21.2 93.88,88.27 R23.2 97.16,79.91 97.16,69.85 102.55,64.45 102.55,60.01 C20.+
  Top 1.016: D8.A 75.56,7.62 76.83,8.89 90.17,8.89 X2.P$1
  Top 2.54: L1.P$3 L1.P$4 92.71,67.31 101.6,58.42 C20.+ 99.69,58.42 93.34,52.07 C21.+ 93.34,46.36 100.33,39.37 C22.+ 100.33,35.56 95.88,35.56 93.34,33.02 C23.+
  pour Top (isolate 1.016): 93.34,0.63 93.34,32.38 96.52,35.56 100.33,35.56 102.87,37.47 93.98,46.36 93.98,50.8 99.06,56.52 103.5,56.52 103.5,59.05 95.25,67.31 95.25,79.38 93.98,80.64 88.9,80.64 88.27,80.01 88.27,0 92.71,0
N$40
  Top 0.61: R24.2 82.55,88.17 R25.A
N$41
  Top 0.61: R23.1 90.27,81.91 R25.B
N$42
  Top 0.61: TL2.2 90.11,84.55 C24.2 88.17,84.45 R25.W
N$43
  Top 1.016: D8.K 75.56,2.63 R26.2
N$44
  Top 1.27: C25.2 R27.2
N$52
  pour Top (isolate 1.27, rank 6): 114.94,0 0.63,0 0,0.63 0,161.93 114.3,161.93 114.3,0.63
TR-OUT1
  Top 2.54: 78.1,135.89 T3.10 | 78.1,135.89 D4.C 83.19,135.89 83.79,135.29 102.26,135.29 102.86,135.89 D5.A | T3.9 73.03,140.97 78.1,135.89 | T3.11 73.03,130.81 78.1,135.89
TR-OUT2
  Top 2.54: 78.1,110.49 T3.15 | 78.1,110.49 D7.C 83.19,110.49 83.79,109.89 102.26,109.89 102.86,110.49 D6.A | T3.14 73.03,115.57 78.1,110.49 | T3.16 73.03,105.41 78.1,110.49